# EAGLE design just_a_switch-mk-2.0 (EAGLE 6.5.0)
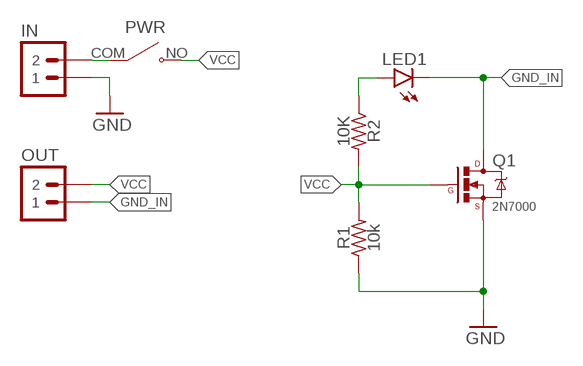
[diagram p0: schematic, sheet 1]

## Parts
IN  M02PTH-CENTERED-R+  [1X02-CENTER-R+]
LED1  LED3MM-LESS  [LED3MM-LESSSILK]
OUT  M02PTH-CENTERED-R+  [1X02-CENTER-R+]
PWR  SWITCH-SPSTROCKER  [SPST-ROCKER-3.81MM]
Q1  2N7000  MOSFET-NCHANNEL2N7000-AMMO  [TO-92-AMMO]
R1  10k  RESISTORPTH-AXIAL-5.08MM  [RESISTOR-AXIAL-PTH-5.08MM]
R2  10K  RESISTORPTH-AXIAL-5.08MM  [RESISTOR-AXIAL-PTH-5.08MM]

## Nets
GND: IN.1 Q1.1(S) R1.P$1
GND_IN: LED1.K(C) OUT.1 Q1.3(D)
N$1: IN.2 PWR.COM
N$2: LED1.A R2.P$1
VCC: OUT.2 PWR.NO Q1.2(G) R1.P$2 R2.P$2

## Library data of the parts
IN OUT = a_parts:M02: Standard 2-pin 0.1" header. Use with - straight break away headers ( PRT-00116) - right angle break away headers (PRT-00553) - swiss pins (PRT-00743) - machine pins (PRT-00117) - female headers (PRT-00115) Molex polarized connector foot print use with: PRT-08233 with associated crimp pins and housings. 2.54_SCREWTERM for use with PRT-10571. 3.5mm Screw Terminal footprints for PRT-08084 5mm Screw Terminal footprints for use with PRT-08433
LED1 = A_butts:LED: LEDs Standard schematic elements and footprints for 5mm, 3mm, 1206, and 0603 sized LEDs. 5mm - Spark Fun Electronics SKU : COM-00529 (and others)
PWR = a_parts:SWITCH-SPST
Q1 = A_butts:MOSFET-NCHANNEL: Common NMOSFET Parts MFG P/N Store ID Prod ID FDD8780 TRANS-09984 SI7820DN TRANS-11055 FDS6630A IC-08089 2N7002PW TRANS-11151 FQP30N06L COM-10213 TRANS-10060 BSS123LT1G TRANS-08345 BSS138 TRANS-00830 BS170 2N7000
R1 R2 = A_butts:RESISTOR: RESISTOR, American symbol

## Board
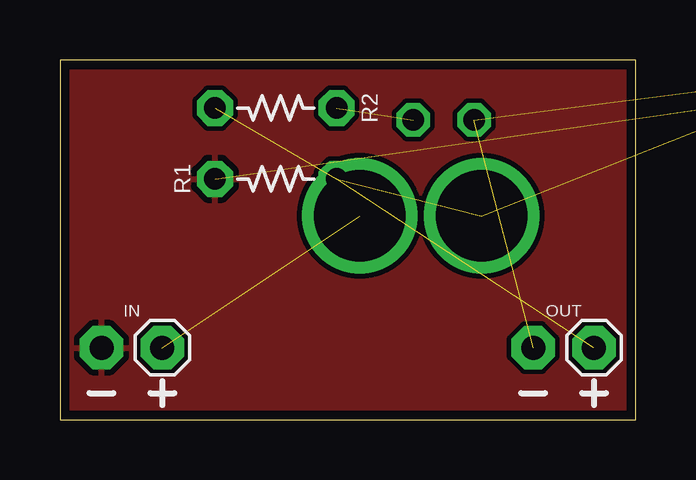
[diagram p1: board, top side]
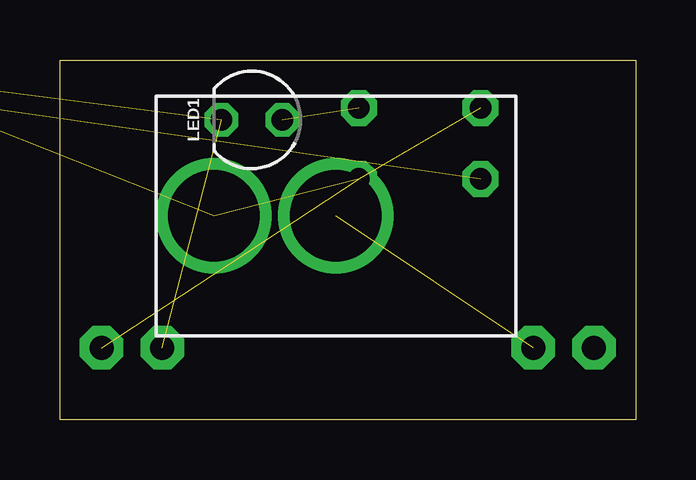
[diagram p2: board, bottom side, seen from below]

Size 24 x 15 mm. Coordinates in mm from the lower left corner, seen from the top.
Outline: 0,15 0,0 24,0 24,15 0,15
Copper layers (1*16): Top 0.0356mm / dielectric 1.5011mm / Bottom 0.0356mm
Design rules "LaenPCBOrder_2": minimum track width 6mil, minimum drill 13mil, track to track 6mil, track to pad 6mil, pad to pad 6mil, via to via 6mil, smd to smd 6mil, copper to edge 15mil, drill to drill 6mil, minimum pad ring 7mil, minimum via ring 7mil, stop-mask expansion 3mil, vias tented up to drill 20mil, thermal gap 10mil

### Footprints (pad centres in the part's own frame; a part is rotated, then mirrored left to right if it is on the bottom)
1X02-CENTER-R+ = drill 1 pad 1.8 octagon: 1 -1.27,0; 2 1.27,0
LED3MM-LESSSILK = drill 0.9 pad 1.4 octagon: A -1.27,0; K 1.27,0
SPST-ROCKER-3.81MM = drill 3.81 pad 4.445: COM 0,0; NO -5.08,0
TO-92-AMMO = drill 0.9 pad 1.5 octagon: 1 -2.54,0; 2 0,0; 3 2.54,0
RESISTOR-AXIAL-PTH-5.08MM = drill 0.9 pad 1.5 octagon: P$1 -2.54,0; P$2 2.54,0

### Placement (x,y rotation side)
IN  3,3 0 top
LED1  16,12.5 180 bottom
OUT  21,3 0 top
PWR  12.5,8.5 0 bottom
Q1  31.46,14 180 top  (outside the outline)
R1  9,10.04 0 top
R2  9,13 180 top

### Tracks (layer width: path | path; a pad name or v marks a point on that pad's centre or on a via)
GND  (1 unrouted)
  pour Top (isolate 0.2): 0,0 0,15 24,15 24,0
GND_IN  (2 unrouted)
N$1  (1 unrouted)
N$2  (1 unrouted)
VCC  (4 unrouted)